# EAGLE schematic Schematic (EAGLE 9.7.0)
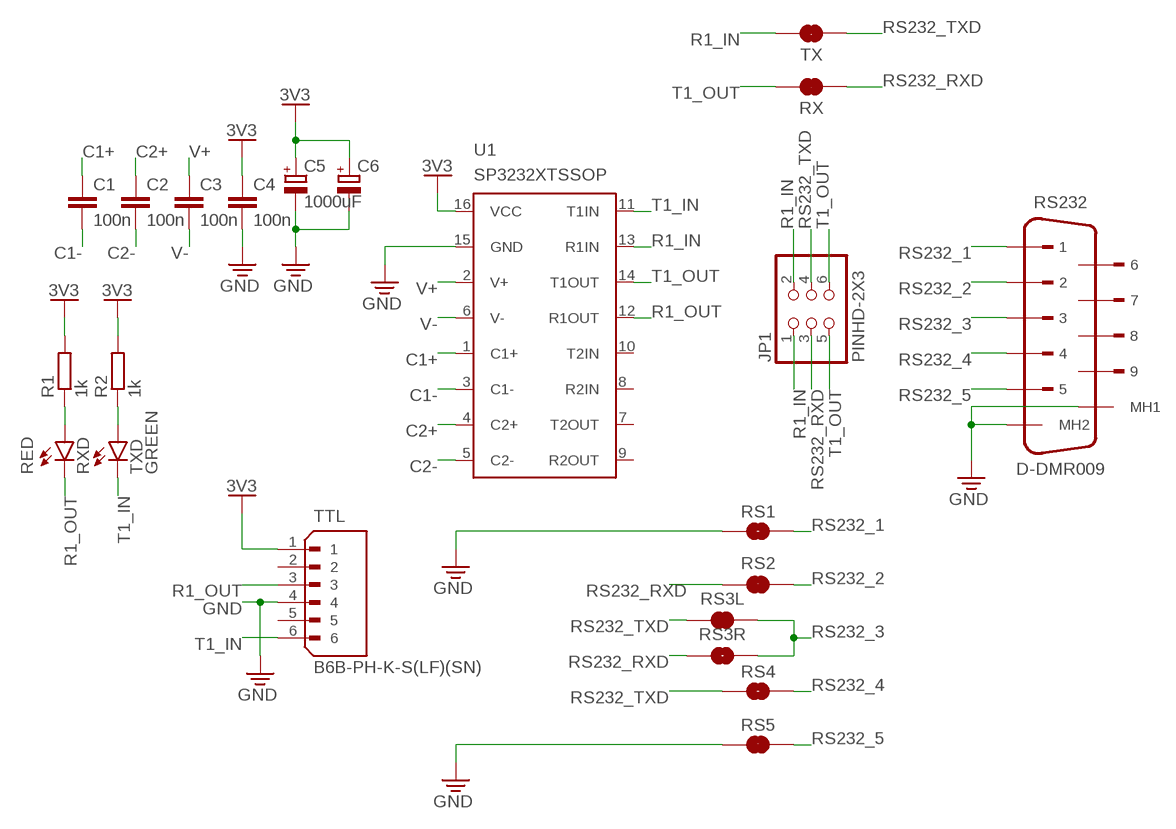
[diagram p0: schematic, sheet 1]

## Parts
C1  100n  C-EUC0402  [C0402]
C2  100n  C-EUC0402  [C0402]
C3  100n  C-EUC0402  [C0402]
C4  100n  C-EUC0402  [C0402]
C5  1000uF  CPOL-EU140CLH-1010  [140CLH-1010]
C6  C-POL_RADIAL-11MM-DIA  [CAPPRD508W65D1000H1100B]
JP1  PINHD-2X3  [2X03]
R1  1k  R-EU_R0402  [R0402]
R2  1k  R-EU_R0402  [R0402]
RS1  JUMPER-SMT_2_NO_SILK  [SMT-JUMPER_2_NO_SILK]
RS2  JUMPER-SMT_2_NO_SILK  JUMPER-SMT_2_NC_TRACE_SILK  [SMT-JUMPER_2_NC_TRACE_SILK]
RS3L  JUMPER-SMT_2_NC_TRACE_SILK  [SMT-JUMPER_2_NC_TRACE_SILK]
RS3R  JUMPER-SMT_2_NC_TRACE_SILK  JUMPER-SMT_2_NO_SILK  [SMT-JUMPER_2_NO_SILK]
RS4  JUMPER-SMT_2_NO_SILK  [SMT-JUMPER_2_NO_SILK]
RS5  JUMPER-SMT_2_NO_SILK  JUMPER-SMT_2_NC_TRACE_SILK  [SMT-JUMPER_2_NC_TRACE_SILK]
RS232  D-DMR009  5747840"  [5747840-4]
RX  JUMPER-SMT_2_NC_TRACE_SILK  [SMT-JUMPER_2_NC_TRACE_SILK]
RXD  RED  LEDCHIP-LED0603  [CHIP-LED0603]
TTL  B6B-PH-K-S(LF)(SN)  [JST_B6B-PH-K-S(LF)(SN)]
TX  JUMPER-SMT_2_NC_TRACE_SILK  [SMT-JUMPER_2_NC_TRACE_SILK]
TXD  GREEN  LEDCHIP-LED0603  [CHIP-LED0603]
U1  SP3232XTSSOP  [TSSOP16]

## Nets
3V3: C4.1 C5.+ C6.1(+) R1.2 R2.2 TTL.1 U1.16(VCC)
C1+: C1.1 U1.1(C1+)
C1-: C1.2 U1.3(C1-)
C2+: C2.1 U1.4(C2+)
C2-: C2.2 U1.5(C2-)
GND: C4.2 C5.- C6.2(-) RS1.1 RS5.1 RS232.MH1(MH2) RS232.MH2(MH1) TTL.4 U1.15(GND)
N$1: R1.1 RXD.A
N$2: R2.1 TXD.A
R1_IN: JP1.1 JP1.2 TX.2 U1.13(R1IN)
R1_OUT: RXD.C TTL.3 U1.12(R1OUT)
RS232_1: RS1.2 RS232.1
RS232_2: RS2.2 RS232.2
RS232_3: RS3L.2 RS3R.2 RS232.3
RS232_4: RS4.2 RS232.4
RS232_5: RS5.2 RS232.5
RS232_RXD: JP1.3 RS2.1 RS3R.1 RX.1
RS232_TXD: JP1.4 RS3L.1 RS4.1 TX.1
T1_IN: TTL.6 TXD.C U1.11(T1IN)
T1_OUT: JP1.5 JP1.6 RX.2 U1.14(T1OUT)
V+: C3.1 U1.2(V+)
V-: C3.2 U1.6(V-)
Unconnected: RS232.6 RS232.7 RS232.8 RS232.9 TTL.2 TTL.5 U1.7(T2OUT) U1.8(R2IN) U1.9(R2OUT) U1.10(T2IN)

## Library data of the parts
C1-C4 = rcl:C-EU: CAPACITOR, European symbol
C5 = rcl:CPOL-EU: POLARIZED CAPACITOR, European symbol
C6 = Capacitor:C-POL: Capacitor Polarised - Generic
JP1 = Connector:PINHD-2X3: PIN HEADER
R1 R2 = rcl:R-EU_: RESISTOR, European symbol
RS1 RS3R RS4 = SparkFun-Jumpers:JUMPER-SMT_2_NO: Normally open jumper This jumper has two pads in close proximity to each other. Apply solder to close the connection. Round pads are easier to solder for beginners, but are a lot larger. SparkFun Product that uses the round pads: SparkFun EL Sequencer <https://www.sparkfun.com/products/12781>
RS2 RS3L RS5 RX TX = SparkFun-Jumpers:JUMPER-SMT_2_NC_TRACE: Normally closed trace jumper This jumper has a trace between two pads so it's normally closed (NC). Use a razor knife to open the connection. For best results follow the IPC guidelines for cutting traces: Cutout at least 0.063 mm (0.005 in). Remove all loose material to clean up the cut area. Seal the cut with an approved epoxy. Reapply solder to reclose the connection.
RS232 = Connector_D-Sub:5747840: D-SUB, 9POS, PLUG, R/A SLDR Datasheet <https://www.te.com/commerce/DocumentDelivery/DDEController?Action=showdoc&DocId=Catalog+Section%7F82068_AMPLIMITE_Right-Angle_Posted_Conn%7F0412%7Fpdf%7FEnglish%7FENG_CS_82068_AMPLIMITE_Right-Angle_Posted_Conn_0412.pdf%7F5747840-4>
RXD TXD = led:LED: LED OSRAM: - CHIPLED LG R971, LG N971, LY N971, LG Q971, LY Q971, LO R971, LY R971 LH N974, LH R974 LS Q976, LO Q976, LY Q976 LO Q996 - Hyper CHIPLED LW Q18S LB Q993, LB Q99A, LB R99A - SideLED LS A670, LO A670, LY A670, LG A670, LP A670 LB A673, LV A673, LT A673, LW A673 LH A674 LY A675 LS A676, LA A676, LO A676, LY A676, LW A676 LS A679, LY A679, LG A679 - Hyper Micro SIDELED® LS Y876, LA Y876, LO Y876, LY Y876 LT Y87S - SmartLED LW L88C, LW L88S LB L89C, LB L89S, LG L890 LS L89K, LO L89K, LY L89K LS L896, LA L896, LO L896, LY L896 - TOPLED LS T670, LO T670, LY T670, LG T670, LP T670 LSG T670, LSP T670, LSY T670, LOP T670, LYG T670 LG T671, LOG T671, LSG T671 LB T673, LV T673, LT T673, LW T673 LH T674 LS T676, LA T676, LO T676, LY T676, LB T676, LH T676, LSB T676, LW T676 LB T67C, LV T67C, LT T67C, LS T67K, LO T67K, LY T67K, LW E67C LS E67B, LA E67B, LO E67B, LY E67B, LB E67C, LV E67C, LT E67C LW T67C LS T679, LY T679, LG T679 LS T770, LO T770, LY T770, LG T770, LP T770 LB T773, LV T773, LT T773, LW T773 LH T774 LS E675, LA E675, LY E675, LS T675 LS T776, LA T776, LO T776, LY T776, LB T776 LHGB T686 LT T68C, LB T68C - Hyper Mini TOPLED® LB M676 - Mini TOPLED Santana® LG M470 LS M47K, LO M47K, LY M47K Source: http://www.osram.convergy.de LUXEON: - LUMILED® LXK2-PW12-R00, LXK2-PW12-S00, LXK2-PW14-U00, LXK2-PW14-V00 LXK2-PM12-R00, LXK2-PM12-S00, LXK2-PM14-U00 LXK2-PE12-Q00, LXK2-PE12-R00, LXK2-PE12-S00, LXK2-PE14-T00, LXK2-PE14-U00 LXK2-PB12-K00, LXK2-PB12-L00, LXK2-PB12-M00, LXK2-PB14-N00, LXK2-PB14-P00, LXK2-PB14-Q00 LXK2-PR12-L00, LXK2-PR12-M00, LXK2-PR14-Q00, LXK2-PR14-R00 LXK2-PD12-Q00, LXK2-PD12-R00, LXK2-PD12-S00 LXK2-PH12-R00, LXK2-PH12-S00 LXK2-PL12-P00, LXK2-PL12-Q00, LXK2-PL12-R00 Source: www.luxeon.com KINGBRIGHT: KA-3528ASYC Source: www.kingbright.com
TTL = B6B-PH-K-S_LF__SN_:B6B-PH-K-S(LF)(SN): Check availability <https://pricing.snapeda.com/parts/B6B-PH-K-S%28LF%29%28SN%29/JST%20Sales%20America%20Inc./view-part?ref=eda>
U1 = SP3232EEY-L:SP3232X: TSSOP16 package for SP3232EEY-L/TR. It could be used with other Exar SP3232 parts with the same package, but it's up to you to check for pinout and spacing. Datasheet <https://www.exar.com/ds/sp3222e_sp3232e.pdf> is available through https://www.exar.com/ds/sp3222e_sp3232e.pdf